# Altium schematic sheet cy18bd103.SchDoc
size A4
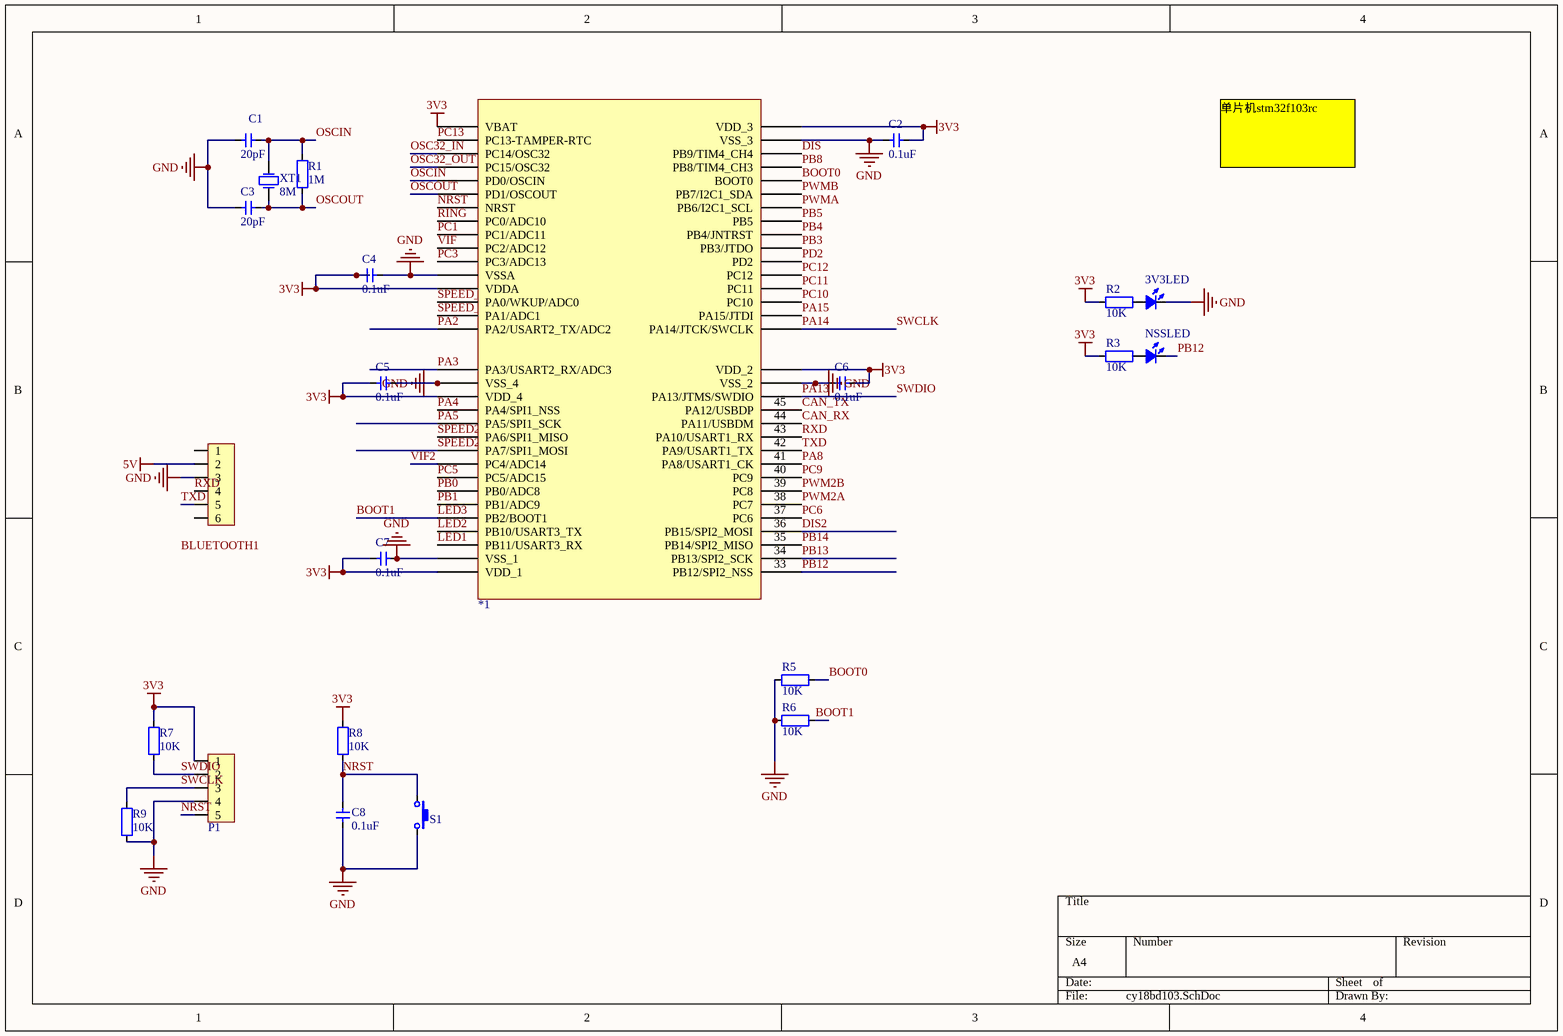
[diagram p0: cy18bd103.SchDoc]

## Parts
3V3LED  LED_0805blue  [LED_0805_YELLOW]  (value not drawn)
*1  STM32F103RC  [LQFP_P0.5_64]  (value not drawn)
BLUETOOTH1  HDR1x6_2.54  [HDR1X6_2.54_180]  (value not drawn)
C1  value 20pF  [CAP_0603]  (hidden comment: Cap_0603)
C2  value 0.1uF  [CAP_0603]  (hidden comment: Cap_0603)
C3  value 20pF  [CAP_0603]  (hidden comment: Cap_0603)
C4  value 0.1uF  [CAP_0603]  (hidden comment: Cap_0603)
C5  value 0.1uF  [CAP_0603]  (hidden comment: Cap_0603)
C6  value 0.1uF  [CAP_0603]  (hidden comment: Cap_0603)
C7  value 0.1uF  [CAP_0603]  (hidden comment: Cap_0603)
C8  value 0.1uF  [CAP_0603]  (hidden comment: Cap_0603)
NSSLED  LED_0805green  [LED_0805_GREEN]  (value not drawn)
P1  HDR1x5_2.54  [HDR1X5_2.54_180]  (value not drawn)
R1  value 1M  [RES_0603]  (hidden comment: Res_0603)
R2  value 10K  [RES_0603]  (hidden comment: Res_0603)
R3  value 10K  [RES_0603]  (hidden comment: Res_0603)
R5  value 10K  [RES_0603]  (hidden comment: Res_0603)
R6  value 10K  [RES_0603]  (hidden comment: Res_0603)
R7  value 10K  [RES_0603]  (hidden comment: Res_0603)
R8  value 10K  [RES_0603]  (hidden comment: Res_0603)
R9  value 10K  [RES_0603]  (hidden comment: Res_0603)
S1  ButtonTACT_3x6x2.5_180  [ButtonTACT_3x6x2.5_180]  (value not drawn)
XT1  value 8M  [XT_5032_2]  (hidden comment: XTAL_32.768kHz)

## Nets
3V3: *1.1(VBAT) *1.13(VDDA) *1.19(VDD_4) *1.32(VDD_1) *1.48(VDD_2) *1.64(VDD_3) C2.2 C4.1 C5.1 C6.2 C7.1 P1.1 R2.1 R3.1 R7.2 R8.2
5V: BLUETOOTH1.2
GND: 3V3LED.2(K) *1.12(VSSA) *1.18(VSS_4) *1.31(VSS_1) *1.47(VSS_2) *1.63(VSS_3) BLUETOOTH1.3 C1.1 C2.1 C3.1 C4.2 C5.2 C6.1 C7.2 C8.1 P1.4 R5.2 R6.2 R9.1 S1.2
BOOT0: *1.60(BOOT0) R5.1
BOOT1: *1.28(PB2/BOOT1) R6.1  [also labelled LED3]
CAN_RX: *1.44(PA11/USBDM)
CAN_TX: *1.45(PA12/USBDP)
DIS: *1.62(PB9/TIM4_CH4)
DIS2: *1.36(PB15/SPI2_MOSI)
LED1: *1.30(PB11/USART3_RX)
LED2: *1.29(PB10/USART3_TX)
NRST: *1.7(NRST) C8.2 P1.5 R8.1 S1.1
OSC32_IN: *1.3(PC14/OSC32)
OSC32_OUT: *1.4(PC15/OSC32)
OSCIN: *1.5(PD0/OSCIN) C1.2 R1.2 XT1.2(OSC2)
OSCOUT: *1.6(PD1/OSCOUT) C3.2 R1.1 XT1.1(OSC1)
PA2: *1.16(PA2/USART2_TX/ADC2)
PA3: *1.17(PA3/USART2_RX/ADC3)
PA4: *1.20(PA4/SPI1_NSS)
PA5: *1.21(PA5/SPI1_SCK)
PA8: *1.41(PA8/USART1_CK)
PA13: *1.46(PA13/JTMS/SWDIO) P1.2 R7.1  [also labelled SWDIO]
PA14: *1.49(PA14/JTCK/SWCLK) P1.3 R9.2  [also labelled SWCLK]
PA15: *1.50(PA15/JTDI)
PB0: *1.26(PB0/ADC8)
PB1: *1.27(PB1/ADC9)
PB3: *1.55(PB3/JTDO)
PB4: *1.56(PB4/JNTRST)
PB5: *1.57(PB5)
PB8: *1.61(PB8/TIM4_CH3)
PB12: *1.33(PB12/SPI2_NSS) NSSLED.2(K)
PB13: *1.34(PB13/SPI2_SCK)
PB14: *1.35(PB14/SPI2_MISO)
PC1: *1.9(PC1/ADC11)
PC3: *1.11(PC3/ADC13)
PC5: *1.25(PC5/ADC15)
PC6: *1.37(PC6)
PC9: *1.40(PC9)
PC10: *1.51(PC10)
PC11: *1.52(PC11)
PC12: *1.53(PC12)
PC13: *1.2(PC13-TAMPER-RTC)
PD2: *1.54(PD2)
PWM2A: *1.38(PC7)
PWM2B: *1.39(PC8)
PWMA: *1.58(PB6/I2C1_SCL)
PWMB: *1.59(PB7/I2C1_SDA)
RING: *1.8(PC0/ADC10)
RXD: *1.43(PA10/USART1_RX) BLUETOOTH1.4
SPEED2_A: *1.22(PA6/SPI1_MISO)
SPEED2_B: *1.23(PA7/SPI1_MOSI)
SPEED_A: *1.14(PA0/WKUP/ADC0)
SPEED_B: *1.15(PA1/ADC1)
TXD: *1.42(PA9/USART1_TX) BLUETOOTH1.5
VIF: *1.10(PC2/ADC12)
VIF2: *1.24(PC4/ADC14)
Net3V3LED_1: 3V3LED.1(A) R2.2
NetNSSLED_1: NSSLED.1(A) R3.2

Not connected (* = marked no-connect by the designer): BLUETOOTH1 1 6

## Notes on the sheet
- 单片机stm32f103rc

## Library data of the parts
3V3LED NSSLED = LED_0805: LED
*1 = STM32F103RC: MCU
BLUETOOTH1 = HDR1x6_2.54: Header
C1-C8 = Cap_0603: Capacitor
P1 = HDR1x5_2.54: Header
R1-R3 R5-R9 = Res_0603: Resistor
S1 = ButtonTACT_3x6x2.5_180: Button
XT1 = XTAL_32.768k: Crystal Oscillator